# Altium schematic sheet introduction.SchDoc: Introduction and PCB renders
size A4; SheetNumber: 2; SheetTotal: 20; TitleBig: Tree Inspection Kit handheld device; Desc_line1: A device capable of determining the microsecond delay between 2 signals coming from piezoelectric probes nailed; Desc_line2: into a tree, trunk or wood board. This allows the indirect calculus of the Modulus of Elasticity in a non-destructive way.
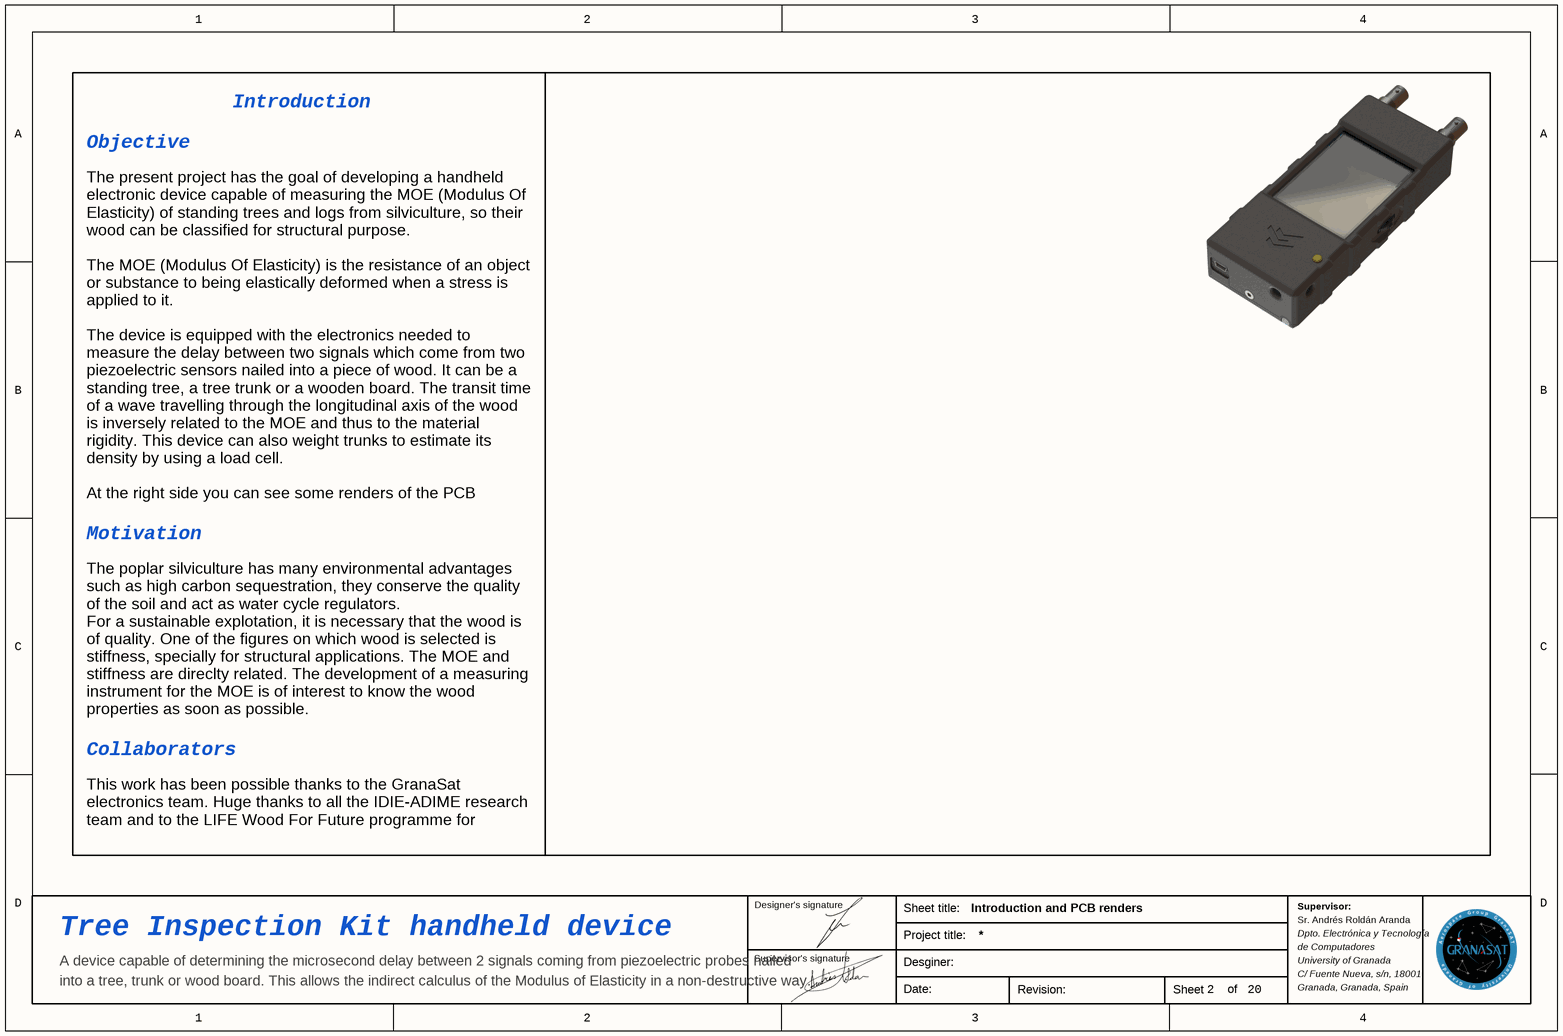
[diagram p0: introduction.SchDoc]

## Notes on the sheet
- Introduction
- Objective
- The present project has the goal of developing a handheld electronic device capable of measuring the MOE (Modulus Of Elasticity) of standing trees and logs from silviculture, so their wood can be classified for structural purpose.
  The MOE (Modulus Of Elasticity) is the resistance of an object or substance to being elastically deformed when a stress is applied to it.
  The device is equipped with the electronics needed to measure the delay between two signals which come from two piezoelectric sensors nailed into a piece of wood. It can be a standing tree, a tree trunk or a wooden board. The transit time of a wave travelling through the longitudinal axis of the wood is inversely related to the MOE and thus to the material rigidity. This device can also weight trunks to estimate its density by using a load cell.
  At the right side you can see some renders of the PCB (version 0.5) which has been manufactured.
- Motivation
- The poplar silviculture has many environmental advantages such as high carbon sequestration, they conserve the quality of the soil and act as water cycle regulators.
  For a sustainable explotation, it is necessary that the wood is of quality. One of the figures on which wood is selected is stiffness, specially for structural applications. The MOE and stiffness are direclty related. The development of a measuring instrument for the MOE is of interest to know the wood properties as soon as possible.
- Collaborators
- This work has been possible thanks to the GranaSat electronics team. Huge thanks to all the IDIE-ADIME research team and to the LIFE Wood For Future programme for offering and financing the project.
- Designer's signature
- Sheet title:
- Sr. Andrés Roldán Aranda
- Supervisor:
- Supervisor's signature
- Project title:
- Desginer:
- Dpto. Electrónica y Tecnología
- de Computadores
- University of Granada
- C/ Fuente Nueva, s/n, 18001
- Granada, Granada, Spain
- Date:
- Revision:
- Sheet
- of